# Altium project Christmas-2024_TSO-PCB.PrjPcb
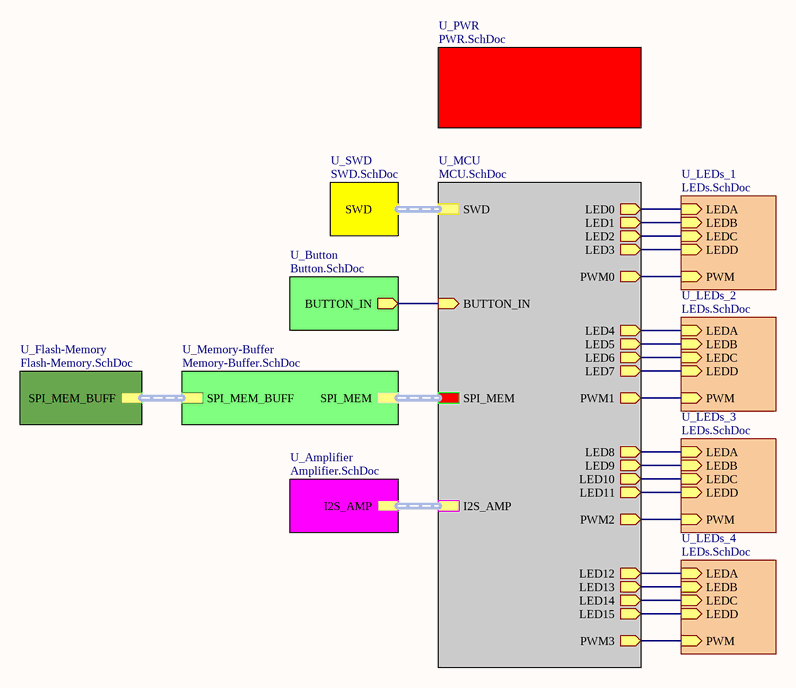
[diagram p0: Christmas-2024_TSO-PCB_MASTER.SchDoc]
9 sheets, 176 parts. Net scope: hierarchical (ports join the sheet entries above them; power ports are global).
Board file: Christmas-2024_TSO-PCB.PcbDoc
Sheets:
  Christmas-2024_TSO-PCB_MASTER.SchDoc
    U_MCU = MCU.SchDoc
    U_PWR = PWR.SchDoc
    U_SWD = SWD.SchDoc
    U_Button = Button.SchDoc
    U_Memory-Buffer = Memory-Buffer.SchDoc
    U_Flash-Memory = Flash-Memory.SchDoc
    U_Amplifier = Amplifier.SchDoc
    U_LEDs_1 = LEDs.SchDoc
    U_LEDs_2 = LEDs.SchDoc
    U_LEDs_3 = LEDs.SchDoc
    U_LEDs_4 = LEDs.SchDoc

## Sheet Christmas-2024_TSO-PCB_MASTER.SchDoc
size A; SheetNumber: 1; SheetTotal: 9

### Sub-sheets
U_Amplifier = Amplifier.SchDoc: I2S_AMP (harness I2S_AMP)
U_Button = Button.SchDoc: BUTTON_IN (out)
U_Flash-Memory = Flash-Memory.SchDoc: SPI_MEM_BUFF (harness SPI_MEM_BUFF)
U_LEDs_1 = LEDs.SchDoc: PWM (in), LEDA (in), LEDB (in), LEDC (in), LEDD (in)
U_LEDs_2 = LEDs.SchDoc: PWM (in), LEDA (in), LEDB (in), LEDC (in), LEDD (in)
U_LEDs_3 = LEDs.SchDoc: PWM (in), LEDA (in), LEDB (in), LEDC (in), LEDD (in)
U_LEDs_4 = LEDs.SchDoc: PWM (in), LEDA (in), LEDB (in), LEDC (in), LEDD (in)
U_MCU = MCU.SchDoc: SPI_MEM (harness SPI_MEM), I2S_AMP (harness I2S_AMP), SWD (harness SWD), BUTTON_IN (in), PWM0 (out), PWM1 (out), PWM2 (out), PWM3 (out), LED0 (out), LED1 (out), LED2 (out), LED3 (out), LED4 (out), LED5 (out), LED6 (out), LED7 (out), LED8 (out), LED9 (out), LED10 (out), LED11 (out), LED12 (out), LED13 (out), LED14 (out), LED15 (out)
U_Memory-Buffer = Memory-Buffer.SchDoc: SPI_MEM (harness SPI_MEM), SPI_MEM_BUFF (harness SPI_MEM_BUFF)
U_PWR = PWR.SchDoc: no entries
U_SWD = SWD.SchDoc: SWD (harness SWD)

### Nets
LED0: sheet U_MCU/LED0, sheet U_LEDs_1/LEDA
LED1: sheet U_MCU/LED1, sheet U_LEDs_1/LEDB
LED2: sheet U_MCU/LED2, sheet U_LEDs_1/LEDC
LED3: sheet U_MCU/LED3, sheet U_LEDs_1/LEDD
LED4: sheet U_MCU/LED4, sheet U_LEDs_2/LEDA
LED5: sheet U_MCU/LED5, sheet U_LEDs_2/LEDB
LED6: sheet U_MCU/LED6, sheet U_LEDs_2/LEDC
LED7: sheet U_MCU/LED7, sheet U_LEDs_2/LEDD
LED8: sheet U_MCU/LED8, sheet U_LEDs_3/LEDA
LED9: sheet U_MCU/LED9, sheet U_LEDs_3/LEDB
LED10: sheet U_MCU/LED10, sheet U_LEDs_3/LEDC
LED11: sheet U_MCU/LED11, sheet U_LEDs_3/LEDD
LED12: sheet U_MCU/LED12, sheet U_LEDs_4/LEDA
LED13: sheet U_MCU/LED13, sheet U_LEDs_4/LEDB
LED14: sheet U_MCU/LED14, sheet U_LEDs_4/LEDC
LED15: sheet U_MCU/LED15, sheet U_LEDs_4/LEDD
PWM0: sheet U_MCU/PWM0, sheet U_LEDs_1/PWM
PWM1: sheet U_MCU/PWM1, sheet U_LEDs_2/PWM
PWM2: sheet U_MCU/PWM2, sheet U_LEDs_3/PWM
PWM3: sheet U_MCU/PWM3, sheet U_LEDs_4/PWM
NetD6_1: sheet U_MCU/BUTTON_IN, sheet U_Button/BUTTON_IN

### Buses and harness runs
harness sheet U_Amplifier/I2S_AMP = sheet U_MCU/I2S_AMP
harness sheet U_Flash-Memory/SPI_MEM_BUFF = sheet U_Memory-Buffer/SPI_MEM_BUFF
harness sheet U_MCU/SPI_MEM = sheet U_Memory-Buffer/SPI_MEM
harness sheet U_MCU/SWD = sheet U_SWD/SWD

## Sheet MCU.SchDoc
size B; SheetNumber: 3; SheetTotal: 9
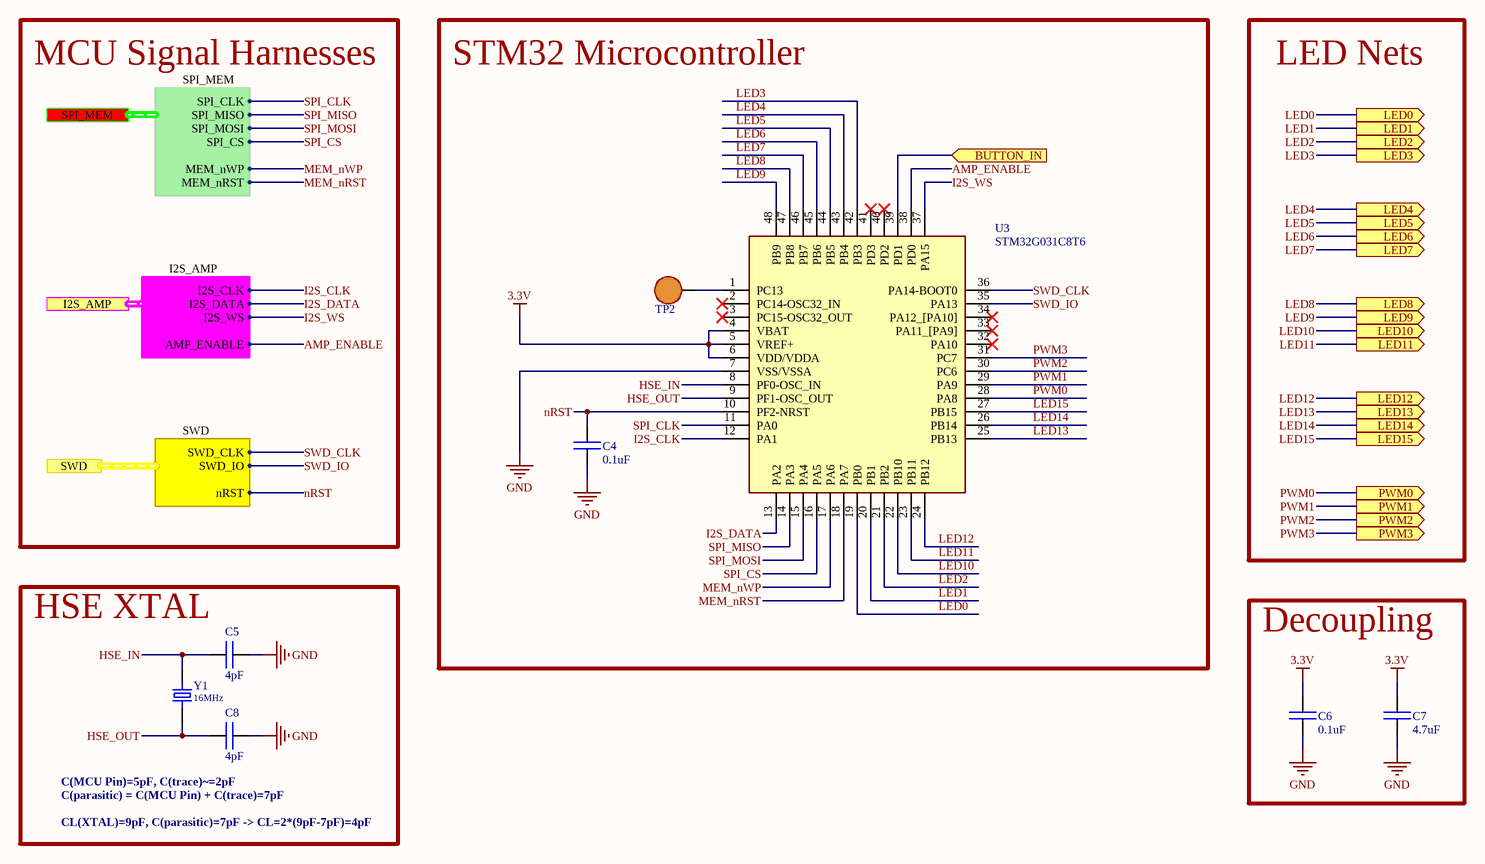
[diagram p1: MCU.SchDoc]

### Parts
C4  value 0.1uF  [0402C]  (hidden comment: CAP)
C5  value 4pF  [0402C]  (hidden comment: CAP)
C6  value 0.1uF  [0402C]  (hidden comment: CAP)
C7  value 4.7uF  [0402C]  (hidden comment: CAP)
C8  value 4pF  [0402C]  (hidden comment: CAP)
TP2  RCWCTE  [RCWCTE]  (value not drawn)
U3  STM32G031C8T6  [48-LQFP]
Y1  16MHz  [4-SMD_NL]

### Blocks framed on the sheet
STM32 Microcontroller: C4 TP2 U3
HSE XTAL: C5 C8 Y1
Decoupling: C6 C7

### Ports
BUTTON_IN (in, see Christmas-2024_TSO-PCB_MASTER[2B], Button[2B]), I2S_AMP (harness I2S_AMP, see Christmas-2024_TSO-PCB_MASTER[2C], Amplifier[1B]), LED0 (out, see Christmas-2024_TSO-PCB_MASTER[3B]), LED1 (out, see Christmas-2024_TSO-PCB_MASTER[3B]), LED2 (out, see Christmas-2024_TSO-PCB_MASTER[3B]), LED3 (out, see Christmas-2024_TSO-PCB_MASTER[3B]), LED4 (out, see Christmas-2024_TSO-PCB_MASTER[3B]), LED5 (out, see Christmas-2024_TSO-PCB_MASTER[3B]), LED6 (out, see Christmas-2024_TSO-PCB_MASTER[3B]), LED7 (out, see Christmas-2024_TSO-PCB_MASTER[3B]), LED8 (out, see Christmas-2024_TSO-PCB_MASTER[3C]), LED9 (out, see Christmas-2024_TSO-PCB_MASTER[3C]), LED10 (out, see Christmas-2024_TSO-PCB_MASTER[3C]), LED11 (out, see Christmas-2024_TSO-PCB_MASTER[3C]), LED12 (out, see Christmas-2024_TSO-PCB_MASTER[3C]), LED13 (out, see Christmas-2024_TSO-PCB_MASTER[3C]), LED14 (out, see Christmas-2024_TSO-PCB_MASTER[3C]), LED15 (out, see Christmas-2024_TSO-PCB_MASTER[3C]), PWM0 (out, see Christmas-2024_TSO-PCB_MASTER[3B]), PWM1 (out, see Christmas-2024_TSO-PCB_MASTER[3B]), PWM2 (out, see Christmas-2024_TSO-PCB_MASTER[3C]), PWM3 (out, see Christmas-2024_TSO-PCB_MASTER[3C]), SPI_MEM (harness SPI_MEM, see Christmas-2024_TSO-PCB_MASTER[2B], Memory-Buffer[1B]), SWD (harness SWD, see Christmas-2024_TSO-PCB_MASTER[2B], SWD[2B])

### Harnesses
SPI_MEM: SPI_CLK, SPI_MOSI, SPI_CS, SPI_MISO, MEM_nWP, MEM_nRST
I2S_AMP: I2S_CLK, I2S_DATA, I2S_WS, AMP_ENABLE
SWD: nRST, SWD_CLK, SWD_IO

### Nets
3.3V: C6.2 C7.2 U3.4(VBAT) U3.5(VREF+) U3.6(VDD/VDDA)
GND: C4.1 C5.1 C6.1 C7.1 C8.1 U3.7(VSS/VSSA)
AMP_ENABLE: U3.38(PD0) ; port I2S_AMP.AMP_ENABLE
HSE_IN: C5.2 U3.8(PF0-OSC_IN) Y1.2
HSE_OUT: C8.2 U3.9(PF1-OSC_OUT) Y1.1
I2S_CLK: U3.12(PA1) ; port I2S_AMP.I2S_CLK
I2S_DATA: U3.13(PA2) ; port I2S_AMP.I2S_DATA
I2S_WS: U3.37(PA15) ; port I2S_AMP.I2S_WS
LED0: U3.19(PB0) ; port LED0
LED1: U3.20(PB1) ; port LED1
LED2: U3.21(PB2) ; port LED2
LED3: U3.42(PB3) ; port LED3
LED4: U3.43(PB4) ; port LED4
LED5: U3.44(PB5) ; port LED5
LED6: U3.45(PB6) ; port LED6
LED7: U3.46(PB7) ; port LED7
LED8: U3.47(PB8) ; port LED8
LED9: U3.48(PB9) ; port LED9
LED10: U3.22(PB10) ; port LED10
LED11: U3.23(PB11) ; port LED11
LED12: U3.24(PB12) ; port LED12
LED13: U3.25(PB13) ; port LED13
LED14: U3.26(PB14) ; port LED14
LED15: U3.27(PB15) ; port LED15
MEM_nRST: U3.18(PA7) ; port SPI_MEM.MEM_nRST
MEM_nWP: U3.17(PA6) ; port SPI_MEM.MEM_nWP
nRST: C4.2 U3.10(PF2-NRST) ; port SWD.nRST
PWM0: U3.28(PA8) ; port PWM0
PWM1: U3.29(PA9) ; port PWM1
PWM2: U3.30(PC6) ; port PWM2
PWM3: U3.31(PC7) ; port PWM3
SPI_CLK: U3.11(PA0) ; port SPI_MEM.SPI_CLK
SPI_CS: U3.16(PA5) ; port SPI_MEM.SPI_CS
SPI_MISO: U3.14(PA3) ; port SPI_MEM.SPI_MISO
SPI_MOSI: U3.15(PA4) ; port SPI_MEM.SPI_MOSI
SWD_CLK: U3.36(PA14-BOOT0) ; port SWD.SWD_CLK
SWD_IO: U3.35(PA13) ; port SWD.SWD_IO
NetD6_1: U3.39(PD1) ; port BUTTON_IN
NetTP2_1: TP2.1 U3.1(PC13)

Not connected (* = marked no-connect by the designer): U3 2(PC14-OSC32_IN)* 3(PC15-OSC32_OUT)* 32(PA10)* 33(PA11_[PA9])* 34(PA12_[PA10])* 40(PD2)* 41(PD3)*

### Notes on the sheet
- MCU Signal Harnesses
- LED Nets
- CL(XTAL)=9pF, C(parasitic)=7pF -> CL=2*(9pF-7pF)=4pF
- (near C8) C(MCU Pin)=5pF, C(trace)~=2pF
- C(parasitic) = C(MCU Pin) + C(trace)=7pF

### Library data of the parts
C4 C6 = CAP: Capacitor; MFR: Samsung; MFR PN: CL05B104KP5NNNC; Type: SMD
C5 C8 = CAP: Capacitor; MFR: Murata; MFR PN: GJM1555C1H4R0BB01D; Type: SMD
C7 = CAP: Capacitor; MFR: Samsung; MFR PN: CL05A475MP5NRNC; Type: SMD
TP2 = TEST POINT: Test Point, Surface Mount; MFR: KOA Speer Electronics, Inc.; MFR PN: RCWCTE; Type: SMD
U3 = STM32G031C6T6: STM32G031C6T6 - ARM MCU, STM32 Family STM32G0 Series Microcontrollers, ARM Cortex-M0+, 32bit, 64 MHz, 64 KB, 8 KB; MFR: STMicroelectronics; MFR PN: STM32G031C8T6; Vendor: *; Vendor PN: *; Vendor Link: *; Type: SMD
Y1 = 16 MHz XTAL: CRYSTAL 16.0000MHZ 9PF SMD; MFR: EPSON; MFR PN: TSX-3225 16.0000MF09Z-AC0; Type: SMD; Frequency: 16MHz

## Sheet PWR.SchDoc
size B; SheetNumber: 2; SheetTotal: 9
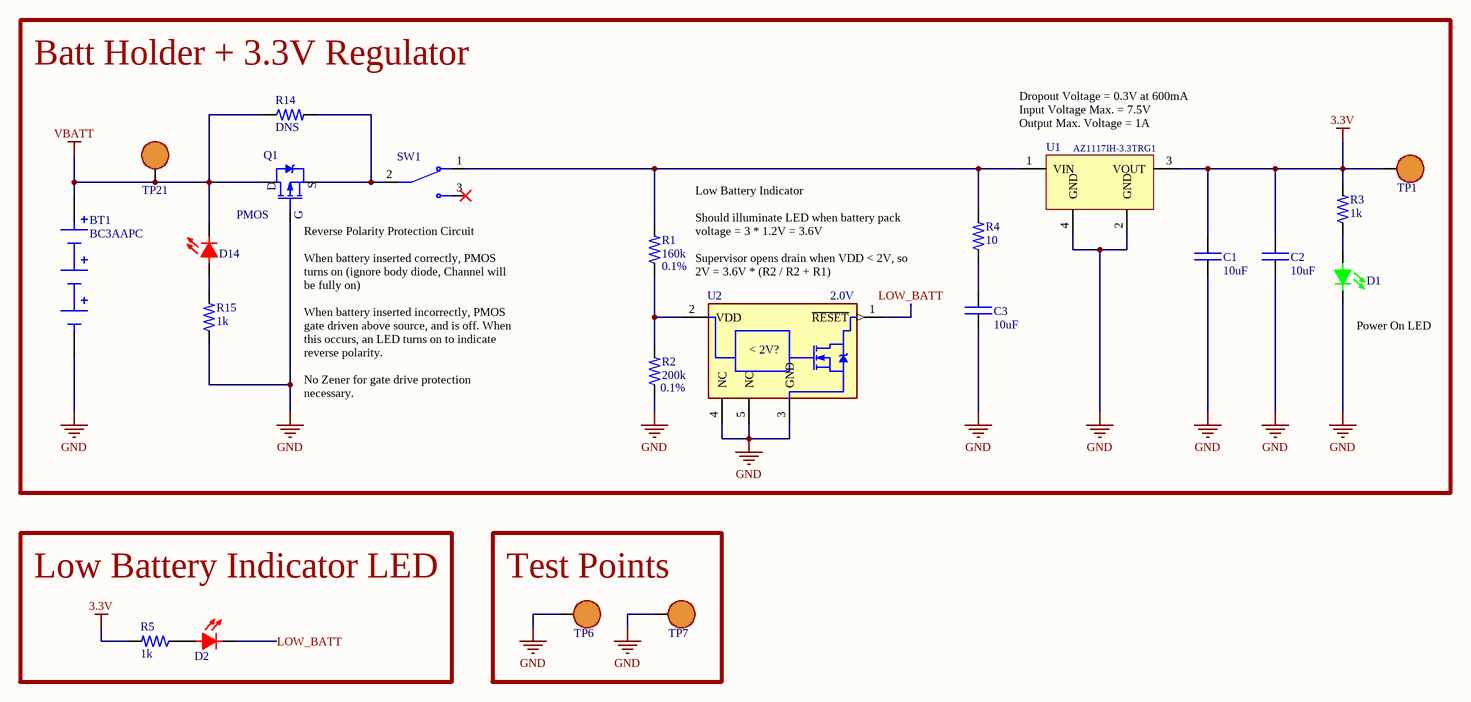
[diagram p2: PWR.SchDoc]

### Parts
BT1  BC3AAPC  [BAT_BC3AAPC]
C1  value 10uF  [0603C]  (hidden comment: CAP)
C2  value 10uF  [0603C]  (hidden comment: CAP)
C3  value 10uF  [0603C]  (hidden comment: CAP)
D1  LED - GREEN  [LED - 0603 - GREEN]  (value not drawn)
D2  LED - RED  [LED - 0603 - RED]  (value not drawn)
D14  LED - RED  [LED - 0603 - RED]  (value not drawn)
Q1  PMOS  [SOT-23]
R1  value 160k  Tolerance: 0.1%  [0402R]  (hidden comment: RES)
R2  value 200k  Tolerance: 0.1%  [0402R]  (hidden comment: RES)
R3  value 1k  [0402R]  (hidden comment: RES)
R4  value 10  [0805R]  (hidden comment: RES)
R5  value 1k  [0402R]  (hidden comment: RES)
R14  value DNS  [0805R]  (hidden comment: RES)
R15  value 1k  [0402R]  (hidden comment: RES)
SW1  SPDT TOGGLE SWITCH  [SW_100SP1T2B4M6QE]  (value not drawn)
TP1  RCWCTE  [RCWCTE]  (value not drawn)
TP6  RCWCTE  [RCWCTE]  (value not drawn)
TP7  RCWCTE  [RCWCTE]  (value not drawn)
TP21  RCWCTE  [RCWCTE]  (value not drawn)
U1  AZ1117IH-3.3TRG1  [SOT-223-3]
U2  2.0V  [SOT-23-5]

### Blocks framed on the sheet
Batt Holder + 3.3V Regulator: BT1 C1-C3 D1 D14 Q1 R1-R4 R14 R15 SW1 TP1 TP21 U1 U2
Low Battery Indicator LED: D2 R5
Test Points: TP6 TP7

### Nets
3.3V: C1.2 C2.2 R3.2 R5.2 TP1.1 U1.3(VOUT)
GND: BT1.NEG C1.1 C2.1 C3.1 D1.2(C) Q1.1(G) R2.1 R15.1 TP6.1 TP7.1 U1.2(GND) U1.4(GND) U2.3(GND) U2.4(NC) U2.5(NC)
VBATT: BT1.POS D14.2(C) Q1.3(D) R14.1 TP21.1
LOW_BATT: D2.2(C) U2.1(~{RESET})
NetC3_2: C3.2 R4.1
NetD1_1: D1.1(A) R3.1
NetD2_1: D2.1(A) R5.1
NetD14_1: D14.1(A) R15.2
NetQ1_2: Q1.2(S) R14.2 SW1.2
NetR1_1: R1.1 R2.2 U2.2(VDD)
NetR1_2: R1.2 R4.2 SW1.1 U1.1(VIN)

Not connected (* = marked no-connect by the designer): SW1 3*

### Notes on the sheet
- (near U1) Dropout Voltage = 0.3V at 600mA
  Input Voltage Max. = 7.5V
  Output Max. Voltage = 1A
- Low Battery Indicator
  Should illuminate LED when battery pack voltage = 3 * 1.2V = 3.6V
  Supervisor opens drain when VDD < 2V, so 2V = 3.6V * (R2 / R2 + R1)
- (near D1) Power On LED
- (near Q1) Reverse Polarity Protection Circuit
  When battery inserted correctly, PMOS turns on (ignore body diode, Channel will be fully on)
  When battery inserted incorrectly, PMOS gate driven above source, and is off. When this occurs, an LED turns on to indicate reverse polarity.
  No Zener for gate drive protection necessary.
- (in symbol SUPERVISOR 2V AL OD) < 2V?

### Library data of the parts
BT1 = BC3AAPC: Holder Batt 3-AA Cells Pc Mnt; MFR: MPD (Memory Protection Devices); MFR PN: BC3AAPC; Type: TH
C1-C3 = CAP: Capacitor; MFR: Samsung; MFR PN: CL10A106MQ8NNNC; Type: SMD
D1 = LED - GREEN: LED, Green, 0603; MFR: Dialight; MFR PN: 5988070107F; Type: SMD; Vf: 2V; Color: Green
D2 D14 = LED - RED: LED, Red, 0603; MFR: Würth Elektronik; MFR PN: 150060RS75000; Type: SMD; Vf: 2V; Color: Red
Q1 = PMOS: P-Channel MOSFET, 4.2A, 20V, , 52mOhm max, 1.4W; MFR: Diodes Incorporated; MFR PN: DMG2305UX-7; Type: SMD; Value: *
R1 = RES: Resistor; MFR PN: RT0402BRD07160KL; MFR: YAGEO; Type: SMD
R2 = RES: Resistor; MFR PN: RT0402BRD07200KL; MFR: YAGEO; Type: SMD
R3 R5 R15 = RES: Resistor; MFR PN: RC0402JR-071KL; MFR: YAGEO; Type: SMD
R4 = RES: Resistor; MFR PN: CRCW080510R0FKEAHP; MFR: Vishay Dale; Type: SMD
R14 = RES: Resistor; MFR PN: *; MFR: *; Type: SMD
SW1 = SPDT TOGGLE SWITCH: Toggle Switch, 100 Series, SPDT, ON-NONE-ON, Sealed, 5A, 120VAC, 28VDC, R/A PC; MFR: E-Switch; MFR PN: 100SP1T2B4M6QE; Type: TH
TP1 TP6 TP7 TP21 = TEST POINT: as TP2 on sheet MCU; MFR PN: RCWCTE; Type: SMD
U1 = LIN REG 3.3V 1A: IC REG LINEAR 3.3V 1A SOT223; MFR: Texas Instruments; MFR PN: LM3940IMPX-3.3/NOPB; Type: SMD
U2 = SUPERVISOR 2V AL OD: Low-voltage supervisor with adjustable-reset time delay and manual reset; MFR PN: TLV840NADL20DBVR; MFR: Texas Instruments; Type: SMD

## Sheet SWD.SchDoc
size A; SheetNumber: 4; SheetTotal: 9
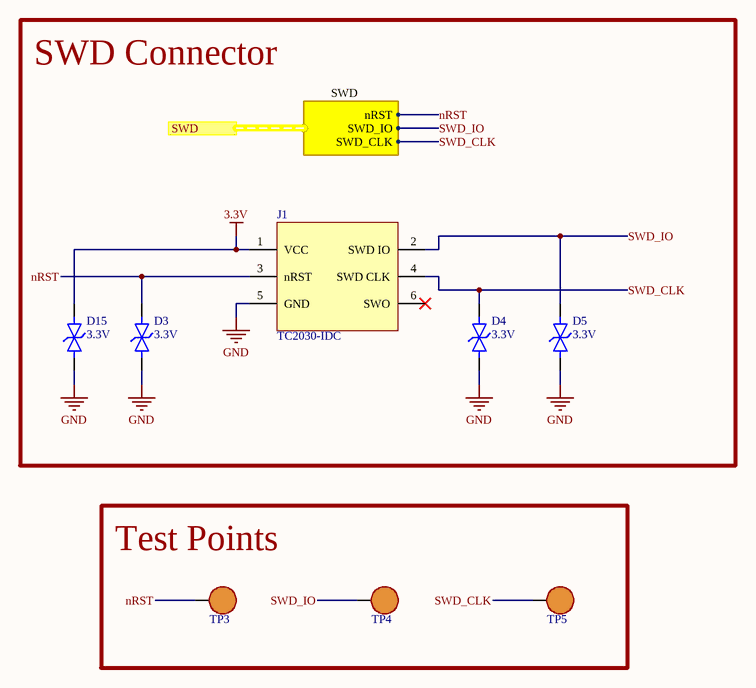
[diagram p3: SWD.SchDoc]

### Parts
D3  VRS: 3.3V  [0402-TVS]  (hidden comment: DESD3V3E1BL-7B)
D4  VRS: 3.3V  [0402-TVS]  (hidden comment: DESD3V3E1BL-7B)
D5  VRS: 3.3V  [0402-TVS]  (hidden comment: DESD3V3E1BL-7B)
D15  VRS: 3.3V  [0402-TVS]  (hidden comment: DESD3V3E1BL-7B)
J1  TC2030-IDC  [TAG CONNECT TC2030IDC - NO 3D MODEL]
TP3  RCWCTE  [RCWCTE]  (value not drawn)
TP4  RCWCTE  [RCWCTE]  (value not drawn)
TP5  RCWCTE  [RCWCTE]  (value not drawn)

### Blocks framed on the sheet
SWD Connector: D3-D5 D15 J1
Test Points: TP3-TP5

### Ports
SWD (harness SWD, see Christmas-2024_TSO-PCB_MASTER[2B], MCU[1C])

### Harnesses
SWD: SWD_CLK, SWD_IO, nRST

### Nets
3.3V: D15.1 J1.1(VCC)
GND: D3.2 D4.2 D5.2 D15.2 J1.5(GND)
nRST: D3.1 J1.3(nRST) TP3.1 ; port SWD.nRST
SWD_CLK: D4.1 J1.4(SWD_CLK) TP5.1 ; port SWD.SWD_CLK
SWD_IO: D5.1 J1.2(SWD_IO) TP4.1 ; port SWD.SWD_IO

Not connected (* = marked no-connect by the designer): J1 6(SWO)*

### Library data of the parts
D3-D5 D15 = TVS Diode 3.3V Bi: TVS DIODE 3.3VWM 7VC DFN1006-2; MFR: Diodes Incorporated; Type: SMD; VBR: 3.8V; VC: 7V; MFR PN: DESD3V3E1BL-7B
J1 = TC2030-IDC: "Plug of Nails" POGO Pin connector; MFR PN: TC2030-IDC-NL; MFR: Tag-Connect; Value: DNS
TP3-TP5 = TEST POINT: as TP2 on sheet MCU; MFR PN: RCWCTE; Type: SMD

## Sheet Button.SchDoc
size A; SheetNumber: 5; SheetTotal: 9
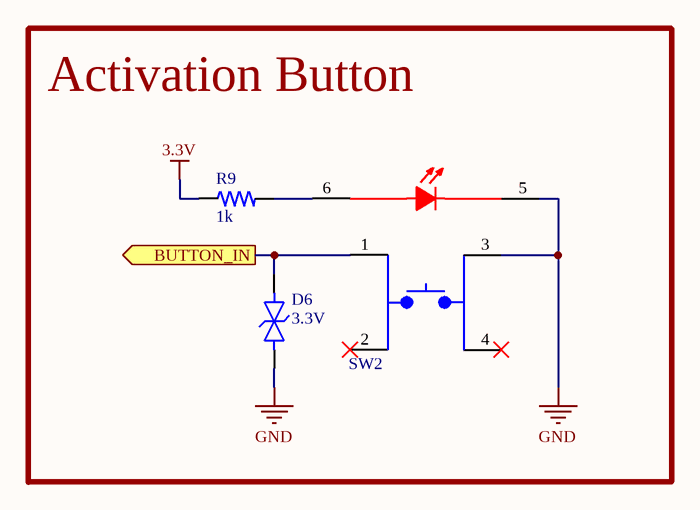
[diagram p4: Button.SchDoc]

### Parts
D6  VRS: 3.3V  [0402-TVS]  (hidden comment: DESD3V3E1BL-7B)
R9  value 1k  [0402R]  (hidden comment: RES)
SW2  SPDT PUSH BUTTON SWITCH  [TL1265RQSCLR]  (value not drawn)

### Blocks framed on the sheet
Activation Button: D6 R9 SW2

### Ports
BUTTON_IN (out, see Christmas-2024_TSO-PCB_MASTER[2B], MCU[4B])

### Nets
3.3V: R9.1
GND: D6.2 SW2.3 SW2.5
NetD6_1: D6.1 SW2.1 ; port BUTTON_IN
NetR9_2: R9.2 SW2.6

Not connected (* = marked no-connect by the designer): SW2 2* 4*

### Library data of the parts
D6 = TVS Diode 3.3V Bi: as D3 on sheet SWD; MFR PN: DESD3V3E1BL-7B
R9 = RES: as R3 on sheet PWR; Type: SMD
SW2 = SPDT PUSH BUTTON SWITCH: SWITCH TACTILE SPST-NO 0.05A 12V, Red Illumination; MFR: E-Switch; MFR PN: TL1265RQSCLR; Type: SMD

## Sheet Memory-Buffer.SchDoc
size B; SheetNumber: 7; SheetTotal: 9
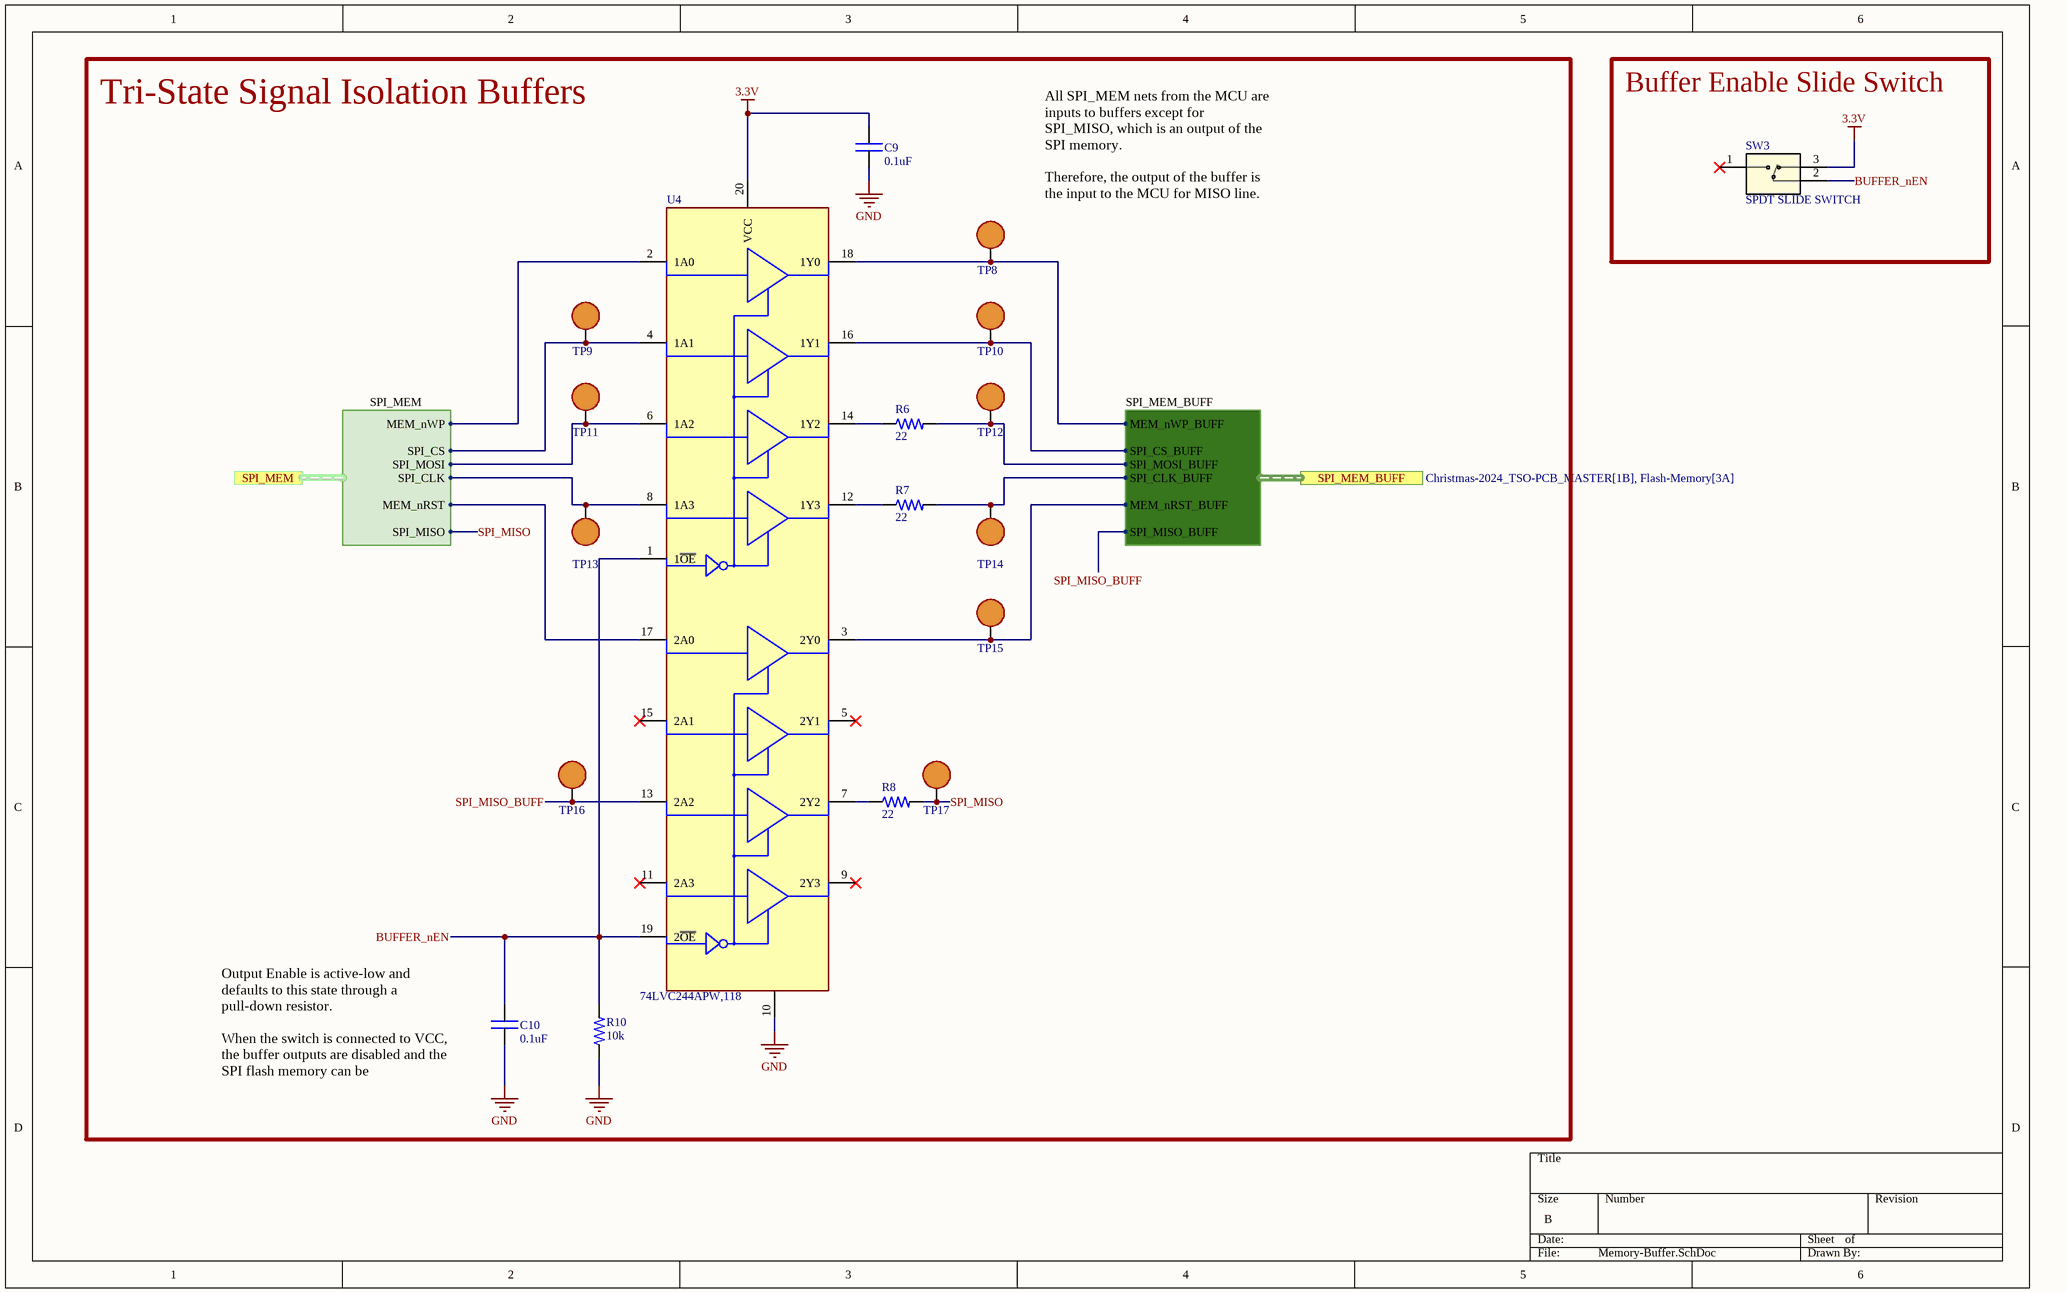
[diagram p5: Memory-Buffer.SchDoc]

### Parts
C9  value 0.1uF  [0402C]  (hidden comment: CAP)
C10  value 0.1uF  [0402C]  (hidden comment: CAP)
R6  value 22  [0402R]  (hidden comment: RES)
R7  value 22  [0402R]  (hidden comment: RES)
R8  value 22  [0402R]  (hidden comment: RES)
R10  value 10k  [0402R]  (hidden comment: RES)
SW3  SPDT SLIDE SWITCH  [CJS-1200TB]
TP8  RCWCTE  [TP - SMALL]  (value not drawn)
TP9  RCWCTE  [TP - SMALL]  (value not drawn)
TP10  RCWCTE  [TP - SMALL]  (value not drawn)
TP11  RCWCTE  [TP - SMALL]  (value not drawn)
TP12  RCWCTE  [TP - SMALL]  (value not drawn)
TP13  RCWCTE  [TP - SMALL]  (value not drawn)
TP14  RCWCTE  [TP - SMALL]  (value not drawn)
TP15  RCWCTE  [TP - SMALL]  (value not drawn)
TP16  RCWCTE  [TP - SMALL]  (value not drawn)
TP17  RCWCTE  [TP - SMALL]  (value not drawn)
U4  74LVC244APW,118  [20-TSSOP]

### Blocks framed on the sheet
Tri-State Signal Isolation Buffers: C9 C10 R6-R8 R10 TP8-TP17 U4
Buffer Enable Slide Switch: SW3

### Ports
SPI_MEM (harness SPI_MEM, see Christmas-2024_TSO-PCB_MASTER[2B], MCU[1B]), SPI_MEM_BUFF (harness SPI_MEM_BUFF, see Christmas-2024_TSO-PCB_MASTER[1B], Flash-Memory[3A])

### Harnesses
SPI_MEM: SPI_CLK, SPI_MISO, SPI_MOSI, SPI_CS, MEM_nWP, MEM_nRST
SPI_MEM_BUFF: SPI_CLK_BUFF, SPI_MISO_BUFF, SPI_MOSI_BUFF, SPI_CS_BUFF, MEM_nWP_BUFF, MEM_nRST_BUFF

### Nets
3.3V: C9.2 SW3.3 U4.20(VCC)
GND: C9.1 C10.1 R10.1 U4.10(GND)
BUFFER_nEN: C10.2 R10.2 SW3.2 U4.1(1~{OE}) U4.19(2~{OE})
MEM_nRST: U4.17(2A0) ; port SPI_MEM.MEM_nRST
MEM_nRST_BUFF: TP15.1 U4.3(2Y0) ; port SPI_MEM_BUFF.MEM_nRST_BUFF
MEM_nWP: U4.2(1A0) ; port SPI_MEM.MEM_nWP
MEM_nWP_BUFF: TP8.1 U4.18(1Y0) ; port SPI_MEM_BUFF.MEM_nWP_BUFF
SPI_CLK: TP13.1 U4.8(1A3) ; port SPI_MEM.SPI_CLK
SPI_CLK_BUFF: R7.2 TP14.1 ; port SPI_MEM_BUFF.SPI_CLK_BUFF
SPI_CS: TP9.1 U4.4(1A1) ; port SPI_MEM.SPI_CS
SPI_CS_BUFF: TP10.1 U4.16(1Y1) ; port SPI_MEM_BUFF.SPI_CS_BUFF
SPI_MISO: R8.2 TP17.1 ; port SPI_MEM.SPI_MISO
SPI_MISO_BUFF: TP16.1 U4.13(2A2) ; port SPI_MEM_BUFF.SPI_MISO_BUFF
SPI_MOSI: TP11.1 U4.6(1A2) ; port SPI_MEM.SPI_MOSI
SPI_MOSI_BUFF: R6.2 TP12.1 ; port SPI_MEM_BUFF.SPI_MOSI_BUFF
NetR6_1: R6.1 U4.14(1Y2)
NetR7_1: R7.1 U4.12(1Y3)
NetR8_1: R8.1 U4.7(2Y2)

Not connected (* = marked no-connect by the designer): SW3 1*; U4 5(2Y1)* 9(2Y3)* 11(2A3)* 15(2A1)*

### Notes on the sheet
- All SPI_MEM nets from the MCU are inputs to buffers except for SPI_MISO, which is an output of the SPI memory.
  Therefore, the output of the buffer is the input to the MCU for MISO line.
- Output Enable is active-low and defaults to this state through a pull-down resistor.
  When the switch is connected to VCC, the buffer outputs are disabled and the SPI flash memory can be programmed.

### Library data of the parts
C9 C10 = CAP: as C4 on sheet MCU
R6-R8 = RES: Resistor; MFR PN: RC0402FR-0722RL; MFR: YAGEO; Type: SMD
R10 = RES: Resistor; MFR PN: RC0402JR-0710KL; MFR: YAGEO; Type: SMD
SW3 = SPDT SLIDE SWITCH: MFR: Nidec Components Corporation; MFR PN: CJS-1200TB; Type: SMD
TP8-TP17 = TEST POINT: Test Point, Surface Mount; MFR PN: DNS; MFR: *; Type: SMD
U4 = TRI-STATE BUFFERS 8 CIRC: NXP 74LVC244APW,115 Octal Buffer & Line Driver, 3-State, 1.2  3.6 V, 20-Pin TSSOP; MFR: Nexperia; MFR PN: 74LVC244APW,118; Type: SMD

## Sheet Flash-Memory.SchDoc
size A; SheetNumber: 8; SheetTotal: 9
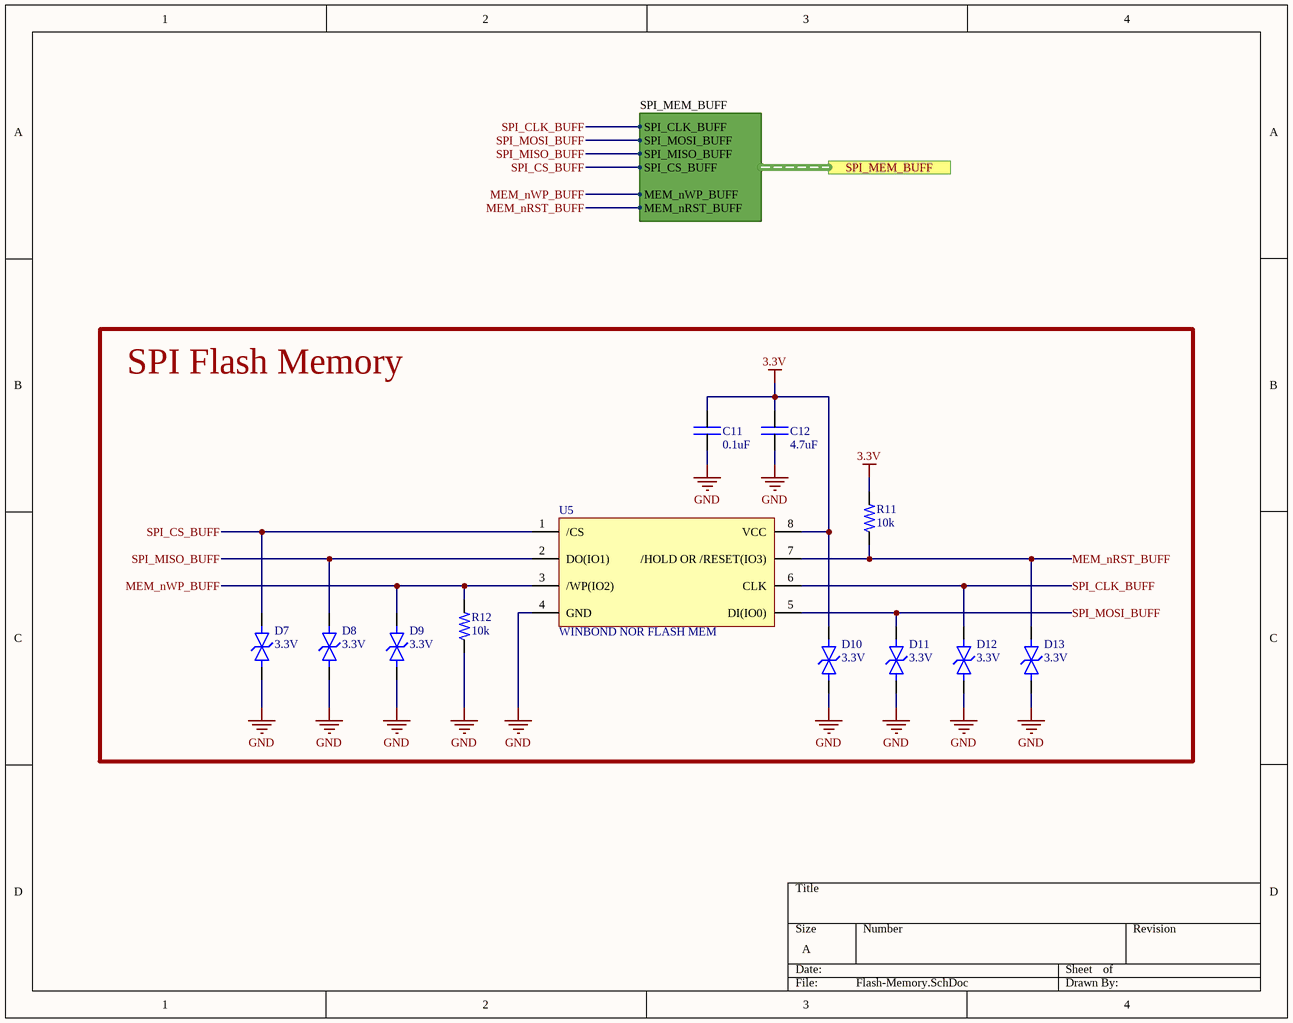
[diagram p6: Flash-Memory.SchDoc]

### Parts
C11  value 0.1uF  [0402C]  (hidden comment: CAP)
C12  value 4.7uF  [0402C]  (hidden comment: CAP)
D7  VRS: 3.3V  [0402-TVS]  (hidden comment: DESD3V3E1BL-7B)
D8  VRS: 3.3V  [0402-TVS]  (hidden comment: DESD3V3E1BL-7B)
D9  VRS: 3.3V  [0402-TVS]  (hidden comment: DESD3V3E1BL-7B)
D10  VRS: 3.3V  [0402-TVS]  (hidden comment: DESD3V3E1BL-7B)
D11  VRS: 3.3V  [0402-TVS]  (hidden comment: DESD3V3E1BL-7B)
D12  VRS: 3.3V  [0402-TVS]  (hidden comment: DESD3V3E1BL-7B)
D13  VRS: 3.3V  [0402-TVS]  (hidden comment: DESD3V3E1BL-7B)
R11  value 10k  [0402R]  (hidden comment: RES)
R12  value 10k  [0402R]  (hidden comment: RES)
U5  WINBOND NOR FLASH MEM  [8-SOIC]

### Blocks framed on the sheet
SPI Flash Memory: C11 C12 D7-D13 R11 R12 U5

### Ports
SPI_MEM_BUFF (harness SPI_MEM_BUFF, see Christmas-2024_TSO-PCB_MASTER[1B], Memory-Buffer[4B])

### Harnesses
SPI_MEM_BUFF: SPI_CLK_BUFF, SPI_MOSI_BUFF, SPI_MISO_BUFF, SPI_CS_BUFF, MEM_nWP_BUFF, MEM_nRST_BUFF

### Nets
3.3V: C11.2 C12.2 D10.1 R11.2 U5.8(VCC)
GND: C11.1 C12.1 D7.2 D8.2 D9.2 D10.2 D11.2 D12.2 D13.2 R12.1 U5.4(GND)
MEM_nRST_BUFF: D13.1 R11.1 U5.7(/HOLD_OR_/RESET(IO3)) ; port SPI_MEM_BUFF.MEM_nRST_BUFF
MEM_nWP_BUFF: D9.1 R12.2 U5.3(/WP(IO2)) ; port SPI_MEM_BUFF.MEM_nWP_BUFF
SPI_CLK_BUFF: D12.1 U5.6(CLK) ; port SPI_MEM_BUFF.SPI_CLK_BUFF
SPI_CS_BUFF: D7.1 U5.1(/CS) ; port SPI_MEM_BUFF.SPI_CS_BUFF
SPI_MISO_BUFF: D8.1 U5.2(DO(IO1)) ; port SPI_MEM_BUFF.SPI_MISO_BUFF
SPI_MOSI_BUFF: D11.1 U5.5(DI(IO0)) ; port SPI_MEM_BUFF.SPI_MOSI_BUFF

### Library data of the parts
C11 = CAP: as C4 on sheet MCU
C12 = CAP: as C7 on sheet MCU
D7-D13 = TVS Diode 3.3V Bi: as D3 on sheet SWD; MFR PN: DESD3V3E1BL-7B
R11 R12 = RES: as R10 on sheet Memory-Buffer; Type: SMD
U5 = WINBOND NOR FLASH MEM: FLASH - NOR Memory IC SPI, 128 Mbit; MFR PN: W25Q128JVSIM; MFR: Winbond; Type: SMD; Value: *

## Sheet Amplifier.SchDoc
size A; SheetNumber: 9; SheetTotal: 9
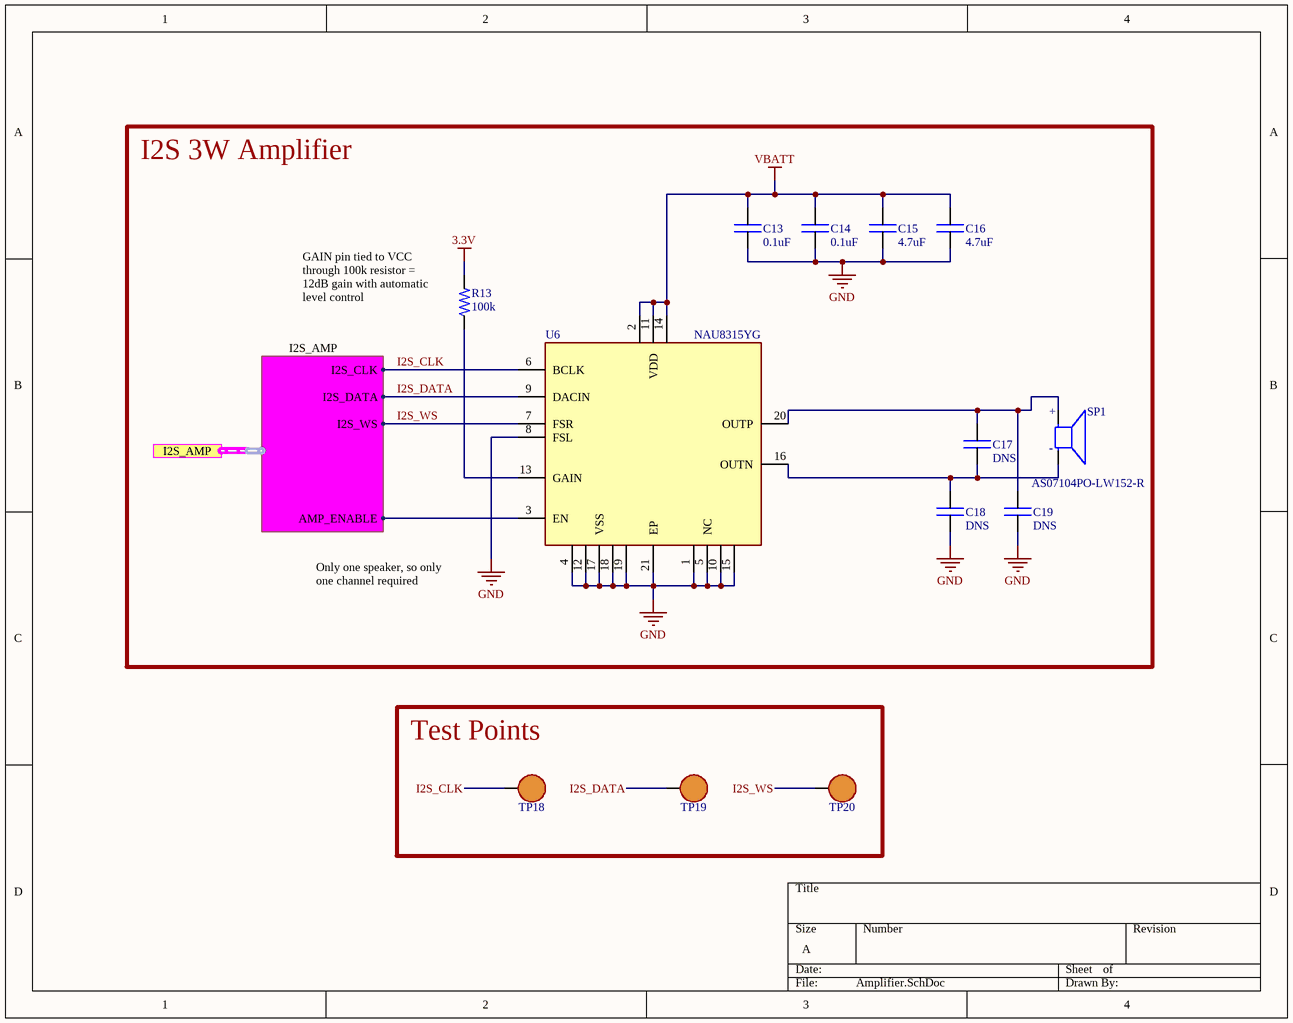
[diagram p7: Amplifier.SchDoc]

### Parts
C13  value 0.1uF  [0402C]  (hidden comment: CAP)
C14  value 0.1uF  [0402C]  (hidden comment: CAP)
C15  value 4.7uF  [0402C]  (hidden comment: CAP)
C16  value 4.7uF  [0402C]  (hidden comment: CAP)
C17  value DNS  [0402C]  (hidden comment: CAP)
C18  value DNS  [0402C]  (hidden comment: CAP)
C19  value DNS  [0402C]  (hidden comment: CAP)
R13  value 100k  [0402R]  (hidden comment: RES)
SP1  AS07104PO-LW152-R  [XMAS_26AWG_AS04004PO-2-LW152-R_SideMount]
TP18  RCWCTE  [RCWCTE]  (value not drawn)
TP19  RCWCTE  [RCWCTE]  (value not drawn)
TP20  RCWCTE  [RCWCTE]  (value not drawn)
U6  NAU8315YG  [20-WFQFN-EP]

### Blocks framed on the sheet
I2S 3W Amplifier: C13-C19 R13 SP1 U6
Test Points: TP18-TP20

### Ports
I2S_AMP (harness I2S_AMP, see Christmas-2024_TSO-PCB_MASTER[2C], MCU[1B])

### Harnesses
I2S_AMP: I2S_CLK, I2S_DATA, I2S_WS, AMP_ENABLE

### Nets
3.3V: R13.2
GND: C13.1 C14.1 C15.1 C16.1 C18.1 C19.1 U6.1(NC) U6.4(VSS) U6.5(NC) U6.8(FSL) U6.10(NC) U6.12(VSS) U6.15(NC) U6.17(VSS) U6.18(VSS) U6.19(VSS) U6.21(EP)
VBATT: C13.2 C14.2 C15.2 C16.2 U6.2(VDD) U6.11(VDD) U6.14(VDD)
AMP_ENABLE: U6.3(EN) ; port I2S_AMP.AMP_ENABLE
I2S_CLK: TP18.1 U6.6(BCLK) ; port I2S_AMP.I2S_CLK
I2S_DATA: TP19.1 U6.9(DACIN) ; port I2S_AMP.I2S_DATA
I2S_WS: TP20.1 U6.7(FSR) ; port I2S_AMP.I2S_WS
NetC17_1: C17.1 C18.2 SP1.N U6.16(OUTN)
NetC17_2: C17.2 C19.2 SP1.P U6.20(OUTP)
NetR13_1: R13.1 U6.13(GAIN)

### Notes on the sheet
- (near R13) GAIN pin tied to VCC through 100k resistor = 12dB gain with automatic level control
- Only one speaker, so only one channel required
- (in symbol SPEAKER 4OHM 3W) +; -

### Library data of the parts
C13 C14 = CAP: as C4 on sheet MCU
C15 C16 = CAP: as C7 on sheet MCU
C17-C19 = CAP: Capacitor; Type: SMD; MFR: *; MFR PN: *
R13 = RES: Resistor; MFR PN: RC0402FR-07100KL; MFR: YAGEO; Type: SMD
SP1 = SPEAKER 4OHM 3W: SPEAKER 4OHM 3W TOP PORT 86DB; MFR: PUI Audio, Inc.; MFR PN: AS04004PO-2-LW152-R; Type: TH; Power Rating: 3W
TP18-TP20 = TEST POINT: as TP2 on sheet MCU; MFR PN: RCWCTE; Type: SMD
U6 = I2S 3W AMP: I2S MONO 3.2W CLASS-D AMPLIFIER; MFR: Nuvoton; MFR PN: NAU8315YG; Value: *; Type: SMD; Power Rating: 3.2W

## Sheet LEDs.SchDoc
size A; SheetNumber: 6; SheetTotal: 9
Used 4 times, as channels U_LEDs_1, U_LEDs_2, U_LEDs_3, U_LEDs_4. Parts and nets are listed once, with the designators drawn on the sheet.
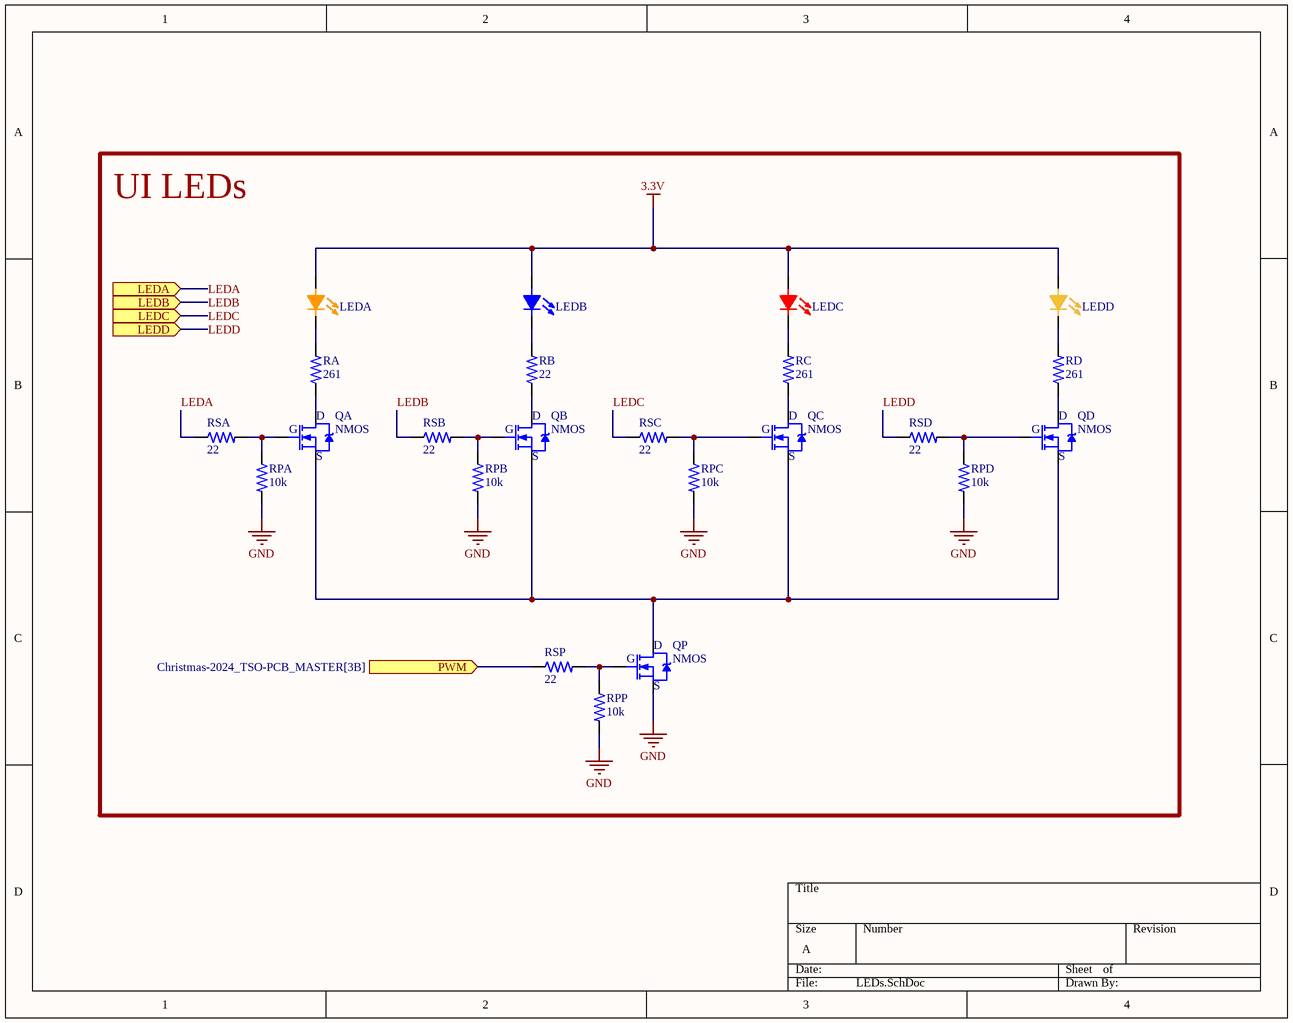
[diagram p8: LEDs.SchDoc]

### Parts
LEDA  LED - ORANGE  [LED - 0603 - ORANGE]  (value not drawn)
LEDB  LED - BLUE  [LED - 0603 - BLUE]  (value not drawn)
LEDC  LED - RED  [LED - 0603 - RED]  (value not drawn)
LEDD  LED - YELLOW  [LED - 0603]  (value not drawn)
QA  NMOS  [SOT-23]
QB  NMOS  [SOT-23]
QC  NMOS  [SOT-23]
QD  NMOS  [SOT-23]
QP  NMOS  [SOT-23]
RA  value 261  [0402R]  (hidden comment: RES)
RB  value 22  [0402R]  (hidden comment: RES)
RC  value 261  [0402R]  (hidden comment: RES)
RD  value 261  [0402R]  (hidden comment: RES)
RPA  value 10k  [0402R]  (hidden comment: RES)
RPB  value 10k  [0402R]  (hidden comment: RES)
RPC  value 10k  [0402R]  (hidden comment: RES)
RPD  value 10k  [0402R]  (hidden comment: RES)
RPP  value 10k  [0402R]  (hidden comment: RES)
RSA  value 22  [0402R]  (hidden comment: RES)
RSB  value 22  [0402R]  (hidden comment: RES)
RSC  value 22  [0402R]  (hidden comment: RES)
RSD  value 22  [0402R]  (hidden comment: RES)
RSP  value 22  [0402R]  (hidden comment: RES)

### Blocks framed on the sheet
UI LEDs: LEDA LEDB LEDC LEDD QA QB QC QD QP RA RB RC RD RPA RPB RPC RPD RPP RSA RSB RSC RSD RSP

### Ports
LEDA (in, see Christmas-2024_TSO-PCB_MASTER[3B]), LEDB (in, see Christmas-2024_TSO-PCB_MASTER[3B]), LEDC (in, see Christmas-2024_TSO-PCB_MASTER[3B]), LEDD (in, see Christmas-2024_TSO-PCB_MASTER[3B]), PWM (in, see Christmas-2024_TSO-PCB_MASTER[3B])

### Nets
3.3V: LEDA.1(A) LEDB.1(A) LEDC.1(A) LEDD.1(A)
GND: QP.2(S) RPA.2 RPB.2 RPC.2 RPD.2 RPP.2
LEDA: RSA.1 ; port LEDA
LEDB: RSB.1 ; port LEDB
LEDC: RSC.1 ; port LEDC
LEDD: RSD.1 ; port LEDD
PWM: RSP.1 ; port PWM
NetLEDA_2: LEDA.2(C) RA.2
NetLEDB_2: LEDB.2(C) RB.2
NetLEDC_2: LEDC.2(C) RC.2
NetLEDD_2: LEDD.2(C) RD.2
NetQA_1: QA.1(G) RPA.1 RSA.2
NetQA_2: QA.2(S) QB.2(S) QC.2(S) QD.2(S) QP.3(D)
NetQA_3: QA.3(D) RA.1
NetQB_1: QB.1(G) RPB.1 RSB.2
NetQB_3: QB.3(D) RB.1
NetQC_1: QC.1(G) RPC.1 RSC.2
NetQC_3: QC.3(D) RC.1
NetQD_1: QD.1(G) RPD.1 RSD.2
NetQD_3: QD.3(D) RD.1
NetQP_1: QP.1(G) RPP.1 RSP.2

### Channels
U_LEDs_1: designators LEDA=LEDA0 LEDB=LEDB0 LEDC=LEDC0 LEDD=LEDD0 QA=QA0 QB=QB0 QC=QC0 QD=QD0 QP=QP0 RA=RA0 RB=RB0 RC=RC0 RD=RD0 RPA=RPA_1 RPB=RPB_1 RPC=RPC_1 RPD=RPD_1 RPP=RPP_1 RSA=RSA_1 RSB=RSB_1 RSC=RSC_1 RSD=RSD_1 RSP=RSP_1; ports LEDA=LED0 LEDB=LED1 LEDC=LED2 LEDD=LED3 PWM=PWM0
U_LEDs_2: designators end in _2; ports LEDA=LED4 LEDB=LED5 LEDC=LED6 LEDD=LED7 PWM=PWM1
U_LEDs_3: designators end in _3; ports LEDA=LED8 LEDB=LED9 LEDC=LED10 LEDD=LED11 PWM=PWM2
U_LEDs_4: designators end in _4; ports LEDA=LED12 LEDB=LED13 LEDC=LED14 LEDD=LED15 PWM=PWM3

### Library data of the parts
LEDA = LED - ORANGE: LED, Orange, 0603; MFR: Lite-On Inc.; MFR PN: LTST-C190KFKT; Vf: 2V; Color: Orange; Type: SMD
LEDB = LED - BLUE: LED, Blue, 0603; MFR: Würth Elektronik; MFR PN: 150060BS75000; Vf: 3.2V; Color: Blue; Type: SMD
LEDC = LED - RED: LED, Red, 0603; MFR: Würth Elektronik; MFR PN: 150060RS75000; Vf: 2V; Color: Red; Type: SMD
LEDD = LED - YELLOW: LED, Yellow, 0603; MFR: Würth Elektronik; MFR PN: 150060YS75000; Vf: 2V; Color: Yellow; Type: SMD
QA QB QC QD QP = NMOS: N-Channel MOSFET; MFR PN: DMN63D8L-7; MFR: Diodes Incorporated; Type: SMD
RA RC RD = RES: Resistor; MFR PN: RC0402FR-07261RL; MFR: YAGEO; Type: SMD
RB RSA RSB RSC RSD RSP = RES: as R6 on sheet Memory-Buffer; Type: SMD
RPA RPB RPC RPD RPP = RES: as R10 on sheet Memory-Buffer; Type: SMD

## Nets that join several sheets
3.3V: MCU (5 pins), PWR (6 pins), SWD (D15.1 J1.1), Button (R9.1), Memory-Buffer (C9.2 SW3.3 U4.20), Flash-Memory (5 pins), Amplifier (R13.2), U_LEDs_1 (LEDA0.1 LEDB0.1 LEDC0.1 LEDD0.1), U_LEDs_2 (LEDA_2.1 LEDB_2.1 LEDC_2.1 LEDD_2.1), U_LEDs_3 (LEDA_3.1 LEDB_3.1 LEDC_3.1 LEDD_3.1), U_LEDs_4 (LEDA_4.1 LEDB_4.1 LEDC_4.1 LEDD_4.1)
GND: MCU (6 pins), PWR (15 pins), SWD (5 pins), Button (D6.2 SW2.3 SW2.5), Memory-Buffer (C9.1 C10.1 R10.1 U4.10), Flash-Memory (11 pins), Amplifier (17 pins), U_LEDs_1 (6 pins), U_LEDs_2 (6 pins), U_LEDs_3 (6 pins), U_LEDs_4 (6 pins)
VBATT: PWR (5 pins), Amplifier (7 pins)
AMP_ENABLE: MCU (U3.38), Amplifier (U6.3)
I2S_CLK: MCU (U3.12), Amplifier (TP18.1 U6.6)
I2S_DATA: MCU (U3.13), Amplifier (TP19.1 U6.9)
I2S_WS: MCU (U3.37), Amplifier (TP20.1 U6.7)
LED0: MCU (U3.19), U_LEDs_1 (RSA_1.1)
LED1: MCU (U3.20), U_LEDs_1 (RSB_1.1)
LED2: MCU (U3.21), U_LEDs_1 (RSC_1.1)
LED3: MCU (U3.42), U_LEDs_1 (RSD_1.1)
LED4: MCU (U3.43), U_LEDs_2 (RSA_2.1)
LED5: MCU (U3.44), U_LEDs_2 (RSB_2.1)
LED6: MCU (U3.45), U_LEDs_2 (RSC_2.1)
LED7: MCU (U3.46), U_LEDs_2 (RSD_2.1)
LED8: MCU (U3.47), U_LEDs_3 (RSA_3.1)
LED9: MCU (U3.48), U_LEDs_3 (RSB_3.1)
LED10: MCU (U3.22), U_LEDs_3 (RSC_3.1)
LED11: MCU (U3.23), U_LEDs_3 (RSD_3.1)
LED12: MCU (U3.24), U_LEDs_4 (RSA_4.1)
LED13: MCU (U3.25), U_LEDs_4 (RSB_4.1)
LED14: MCU (U3.26), U_LEDs_4 (RSC_4.1)
LED15: MCU (U3.27), U_LEDs_4 (RSD_4.1)
MEM_nRST: MCU (U3.18), Memory-Buffer (U4.17)
MEM_nRST_BUFF: Memory-Buffer (TP15.1 U4.3), Flash-Memory (D13.1 R11.1 U5.7)
MEM_nWP: MCU (U3.17), Memory-Buffer (U4.2)
MEM_nWP_BUFF: Memory-Buffer (TP8.1 U4.18), Flash-Memory (D9.1 R12.2 U5.3)
NetD6_1: MCU (U3.39), Button (D6.1 SW2.1)
nRST: MCU (C4.2 U3.10), SWD (D3.1 J1.3 TP3.1)
PWM0: MCU (U3.28), U_LEDs_1 (RSP_1.1)
PWM1: MCU (U3.29), U_LEDs_2 (RSP_2.1)
PWM2: MCU (U3.30), U_LEDs_3 (RSP_3.1)
PWM3: MCU (U3.31), U_LEDs_4 (RSP_4.1)
SPI_CLK: MCU (U3.11), Memory-Buffer (TP13.1 U4.8)
SPI_CLK_BUFF: Memory-Buffer (R7.2 TP14.1), Flash-Memory (D12.1 U5.6)
SPI_CS: MCU (U3.16), Memory-Buffer (TP9.1 U4.4)
SPI_CS_BUFF: Memory-Buffer (TP10.1 U4.16), Flash-Memory (D7.1 U5.1)
SPI_MISO: MCU (U3.14), Memory-Buffer (R8.2 TP17.1)
SPI_MISO_BUFF: Memory-Buffer (TP16.1 U4.13), Flash-Memory (D8.1 U5.2)
SPI_MOSI: MCU (U3.15), Memory-Buffer (TP11.1 U4.6)
SPI_MOSI_BUFF: Memory-Buffer (R6.2 TP12.1), Flash-Memory (D11.1 U5.5)
SWD_CLK: MCU (U3.36), SWD (D4.1 J1.4 TP5.1)
SWD_IO: MCU (U3.35), SWD (D5.1 J1.2 TP4.1)